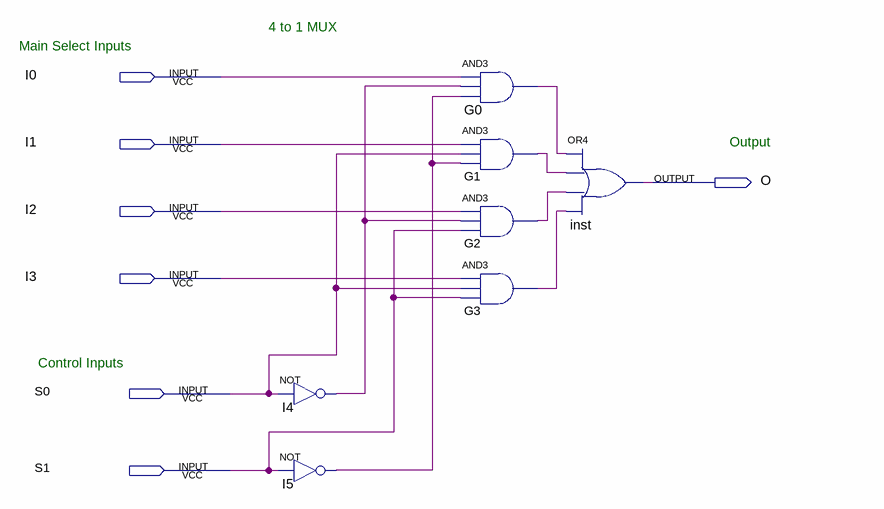
[diagram p0: schematic sheet]
// Quartus schematic 4_to_1_MUX.bdf as structural Verilog: 7 symbols, 7 pins
module \4_to_1_MUX  (
  input  I0,
  input  I1,
  input  I2,
  input  I3,
  input  S0,
  input  S1,
  output O
);

  wire G0_out, G1_out, G2_out, G3_out, I4_out, I5_out;

  not I4 (I4_out, S0);
  not I5 (I5_out, S1);
  and G0 (G0_out, I0, I4_out, I5_out);
  and G1 (G1_out, I1, S0, I5_out);
  and G2 (G2_out, I2, I4_out, S1);
  and G3 (G3_out, I3, S0, S1);
  or inst (O, G0_out, G1_out, G2_out, G3_out);

  // Notes on the sheet:
  //   4 to 1 MUX
  //   Main Select Inputs
  //   Output
  //   Control Inputs
endmodule
